# Altium schematic sheet water_controller_1.SchDoc
size 292 x 138 mm
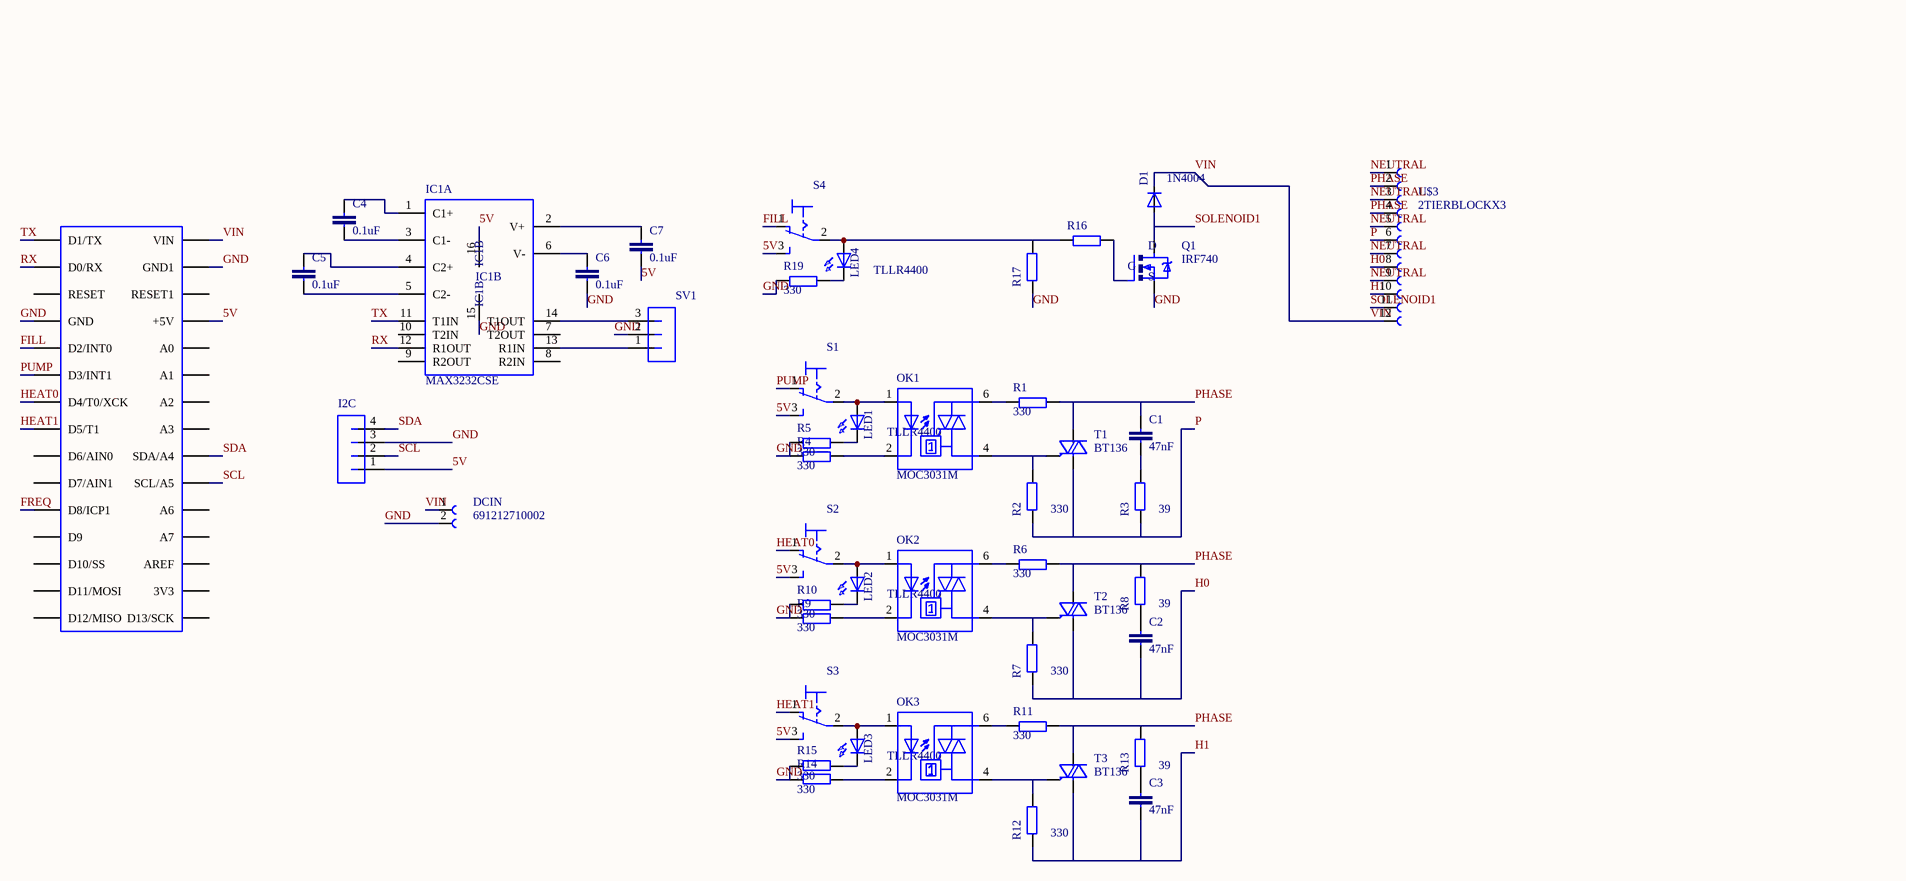
[diagram p0: water_controller_1.SchDoc]

## Parts
C1  47nF  [C150-064X183]
C2  47nF  [C150-064X183]
C3  47nF  [C150-064X183]
C4  0.1uF  [C1210]
C5  0.1uF  [C1210]
C6  0.1uF  [C1210]
C7  0.1uF  [C1210]
D1  1N4004  [DO41-10]
DCIN  691212710002  [691212710002]
I2C  (no value)  [MA04-1]
IC1  MAX3232CSE  [SO16]  (parts A,B of 2)
LED1  TLLR4400  [LED3MM]
LED2  TLLR4400  [LED3MM]
LED3  TLLR4400  [LED3MM]
LED4  TLLR4400  [LED3MM]
OK1  MOC3031M  [DIL06]
OK2  MOC3031M  [DIL06]
OK3  MOC3031M  [DIL06]
Q1  IRF740  [TO220BV]
R1  330  [M1206]
R2  330  [M1206]
R3  39  [M1206]
R4  330  [R1206]
R5  330  [R1206]
R6  330  [M1206]
R7  330  [M1206]
R8  39  [M1206]
R9  330  [R1206]
R10  330  [R1206]
R11  330  [M1206]
R12  330  [M1206]
R13  39  [M1206]
R14  330  [R1206]
R15  330  [R1206]
R16  (no value)  [M1206]
R17  (no value)  [M1206]
R19  330  [R1206]
S1  (no value)  [M9040P]
S2  (no value)  [M9040P]
S3  (no value)  [M9040P]
S4  (no value)  [M9040P]
SV1  (no value)  [MA03-1]
T1  BT136  [TO220AVH]
T2  BT136  [TO220AVH]
T3  BT136  [TO220AVH]
U$1  (no value)  [PDIP-32]
U$3  2TIERBLOCKX3  [2TIERX3]

## Nets
5V: C7.2 I2C.1 IC1.16(VCC) S1.3(S) S2.3(S) S3.3(S) S4.3(S) U$1.+5V
FILL: S4.1(O) U$1.D2(D2/INT0)
FREQ: U$1.D8(D8/ICP1)
GND: C6.2 DCIN.2 I2C.3 IC1.15(GND) Q1.S R4.1 R5.1 R9.1 R10.1 R14.1 R15.1 R17.1 R19.1 SV1.2 U$1.GND U$1.GND1
H0: C2.2 R7.1 T2.1(T1) U$3.8
H1: C3.2 R12.1 T3.1(T1) U$3.10
HEAT0: S2.1(O) U$1.D4(D4/T0/XCK)
HEAT1: S3.1(O) U$1.D5(D5/T1)
NEUTRAL: U$3.1 U$3.3 U$3.5 U$3.7 U$3.9
P: R2.1 R3.1 T1.1(T1) U$3.6
PHASE: C1.1 R1.2 R6.2 R8.2 R11.2 R13.2 T1.2(T2) T2.2(T2) T3.2(T2) U$3.2 U$3.4
PUMP: S1.1(O) U$1.D3(D3/INT1)
RX: IC1.12(R1OUT) U$1.D0/RX
SCL: I2C.2 U$1.A5(SCL/A5)
SDA: I2C.4 U$1.A4(SDA/A4)
SOLENOID1: D1.A Q1.D U$3.11
TX: IC1.11(T1IN) U$1.D1/TX
VIN: D1.C DCIN.1 U$1.VIN U$3.12
NetC1_2: C1.2 R3.2
NetC2_1: C2.1 R8.1
NetC3_1: C3.1 R13.1
NetC4_1: C4.1 IC1.1(C1+)
NetC4_2: C4.2 IC1.3(C1-)
NetC5_1: C5.1 IC1.4(C2+)
NetC5_2: C5.2 IC1.5(C2-)
NetC6_1: C6.1 IC1.6(V-)
NetC7_1: C7.1 IC1.2(V+)
NetIC1_13: IC1.13(R1IN) SV1.1
NetIC1_14: IC1.14(T1OUT) SV1.3
NetLED1_A: LED1.A OK1.1(A) S1.2(P)
NetLED1_K: LED1.K(C) R5.2
NetLED2_A: LED2.A OK2.1(A) S2.2(P)
NetLED2_K: LED2.K(C) R10.2
NetLED3_A: LED3.A OK3.1(A) S3.2(P)
NetLED3_K: LED3.K(C) R15.2
NetLED4_A: LED4.A R16.1 R17.2 S4.2(P)
NetLED4_K: LED4.K(C) R19.2
NetOK1_2: OK1.2(C) R4.2
NetOK1_4: OK1.4(A1) R2.2 T1.3(G)
NetOK1_6: OK1.6(A2) R1.1
NetOK2_2: OK2.2(C) R9.2
NetOK2_4: OK2.4(A1) R7.2 T2.3(G)
NetOK2_6: OK2.6(A2) R6.1
NetOK3_2: OK3.2(C) R14.2
NetOK3_4: OK3.4(A1) R12.2 T3.3(G)
NetOK3_6: OK3.6(A2) R11.1
NetQ1_G: Q1.G R16.2

Not connected (* = marked no-connect by the designer): IC1 7(T2OUT) 8(R2IN) 9(R2OUT) 10(T2IN); U$1 3V3 A0 A1 A2 A3 A6 A7 AREF D6(D6/AIN0) D7(D7/AIN1) D9 D10(D10/SS) D11(D11/MOSI) D12(D12/MISO) D13(D13/SCK) RESET RESET1

## Library data of the parts
C1-C3 = C-EU150-064X183
C4-C7 = C-EUC1210
I2C = MA04-1
R1-R3 R6-R8 R11-R13 R16 R17 = R-EU_M1206
R4 R5 R9 R10 R14 R15 R19 = R-EU_R1206
S1-S4 = M9040P
SV1 = MA03-1
U$1 = ARDUINONANO